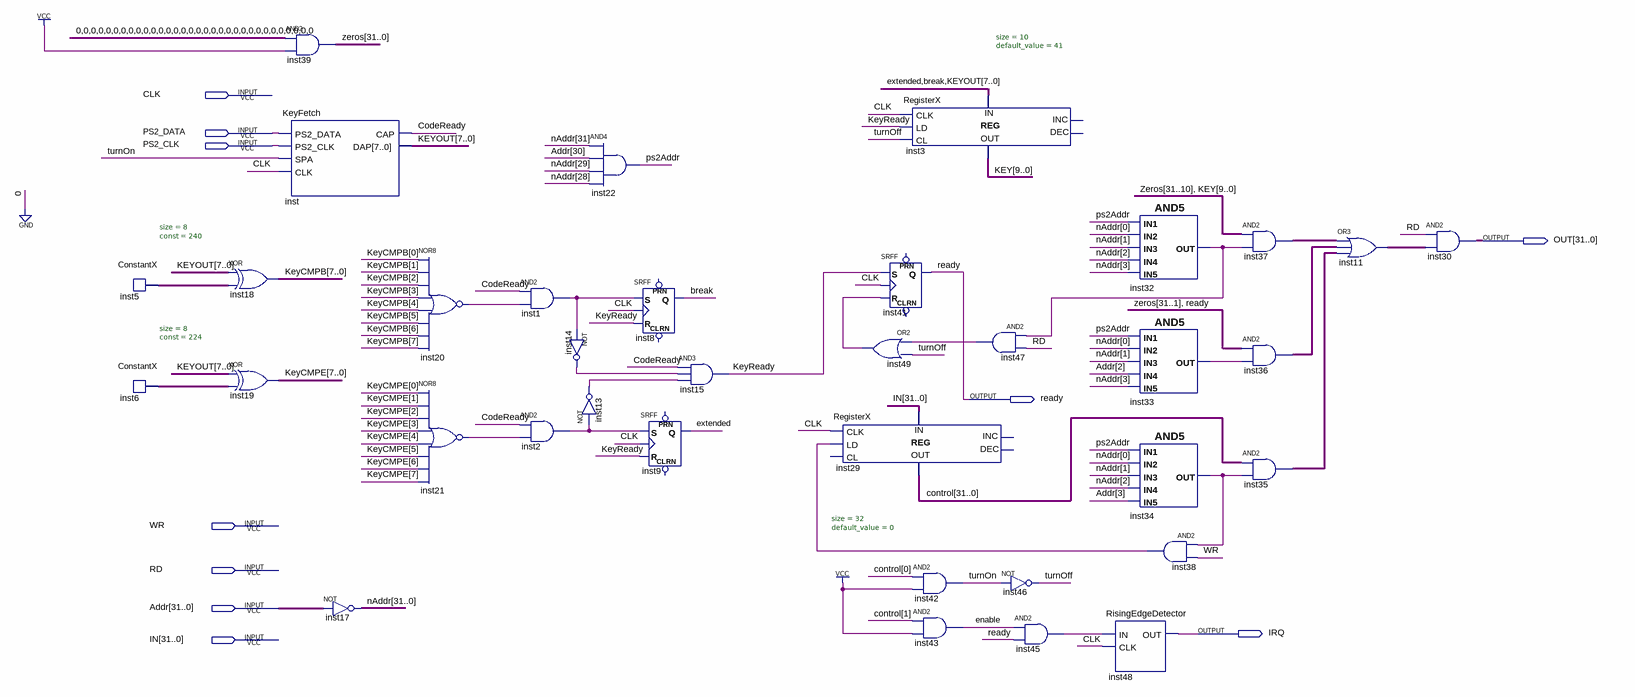
[diagram p0: schematic sheet]
// Quartus schematic KPTastature.bdf as structural Verilog: 36 symbols, 10 pins
module KPTastature (
  input  CLK,
  input  PS2_DATA,
  input  PS2_CLK,
  input  WR,
  input  RD,
  input  [31:0] Addr,
  input  [31:0] IN,
  output [31:0] OUT,
  output ready,
  output IRQ
);

  wire \break , CodeReady, enable, extended, inst1_out, inst2_out, inst13_out, inst14_out, inst20_out,
       inst21_out, inst32_out, inst33_out, inst34_out, inst38_out, inst45_out, inst47_out, inst49_out,
       KeyReady, ps2Addr, turnOff, turnOn;
  wire [7:0] inst5_data_out, inst6_data_out, KeyCMPB, KeyCMPE, KEYOUT;
  wire [9:0] KEY;
  wire [31:0] control, inst11_out, inst35_out, inst36_out, inst37_out, nAddr, zeros;

  ConstantX #(.size(8), .\const (240)) inst5 (.DATA_OUT(inst5_data_out));
  ConstantX #(.size(8), .\const (224)) inst6 (.DATA_OUT(inst6_data_out));
  assign KeyCMPB = KEYOUT ^ inst5_data_out;  // XOR inst18, 8 bits wide
  assign KeyCMPE = KEYOUT ^ inst6_data_out;  // XOR inst19, 8 bits wide
  assign zeros = {32{1'b0}} & {32{1'b1}};  // AND2 inst39, 32 bits wide
  KeyFetch inst (.PS2_DATA(PS2_DATA), .PS2_CLK(PS2_CLK), .SPA(turnOn), .CLK(CLK), .CAP(CodeReady), .DAP(KEYOUT));
  assign nAddr = ~Addr;  // NOT inst17, 32 bits wide
  nor inst20 (inst20_out, KeyCMPB[0], KeyCMPB[1], KeyCMPB[2], KeyCMPB[3], KeyCMPB[4], KeyCMPB[5], KeyCMPB[6], KeyCMPB[7]);
  nor inst21 (inst21_out, KeyCMPE[0], KeyCMPE[1], KeyCMPE[2], KeyCMPE[3], KeyCMPE[4], KeyCMPE[5], KeyCMPE[6], KeyCMPE[7]);
  and inst1 (inst1_out, CodeReady, inst20_out);
  and inst2 (inst2_out, CodeReady, inst21_out);
  and inst22 (ps2Addr, nAddr[31], Addr[30], nAddr[29], nAddr[28]);
  not inst14 (inst14_out, inst1_out);
  not inst13 (inst13_out, inst2_out);
  SRFF inst8 (.S(inst1_out), .R(KeyReady), .CLK(CLK), .Q(\break ));  // open: PRN, CLRN
  SRFF inst9 (.S(inst2_out), .R(KeyReady), .CLK(CLK), .Q(extended));  // open: PRN, CLRN
  and inst15 (KeyReady, CodeReady, inst14_out, inst13_out);
  or inst49 (inst49_out, inst47_out, turnOff);
  RegisterX #(.size(32), .default_value(0)) inst29 (
    .CLK(CLK), .LD(inst38_out), .DATA_IN(IN), .DATA_OUT(control));  // open: CL, INC, DEC
  RegisterX #(.size(10), .default_value(41)) inst3 (
    .CLK(CLK), .LD(KeyReady), .CL(turnOff), .DATA_IN({extended, \break , KEYOUT}), .DATA_OUT(KEY));  // open: INC, DEC
  SRFF inst41 (.S(KeyReady), .R(inst49_out), .CLK(CLK), .Q(ready));  // open: PRN, CLRN
  and inst42 (turnOn, control[0], 1'b1);
  and inst43 (enable, control[1], 1'b1);
  and inst47 (inst47_out, inst32_out, RD);
  not inst46 (turnOff, turnOn);
  and inst45 (inst45_out, enable, ready);
  RisingEdgeDetector inst48 (.IN(inst45_out), .CLK(CLK), .OUT(IRQ));
  and inst32 (inst32_out, ps2Addr, nAddr[0], nAddr[1], nAddr[2], nAddr[3]);
  and inst33 (inst33_out, ps2Addr, nAddr[0], nAddr[1], Addr[2], nAddr[3]);
  and inst34 (inst34_out, ps2Addr, nAddr[0], nAddr[1], nAddr[2], Addr[3]);
  and inst38 (inst38_out, inst34_out, WR);
  assign inst37_out = {zeros[31:10], KEY} & {32{inst32_out}};  // AND2 inst37, 32 bits wide
  assign inst36_out = {zeros[31:1], ready} & {32{inst33_out}};  // AND2 inst36, 32 bits wide
  assign inst35_out = control & {32{inst34_out}};  // AND2 inst35, 32 bits wide
  assign inst11_out = inst37_out | inst36_out | inst35_out;  // OR3 inst11, 32 bits wide
  assign OUT = {32{RD}} & inst11_out;  // AND2 inst30, 32 bits wide
endmodule
